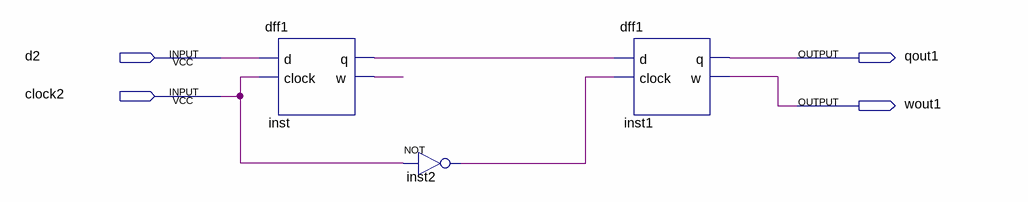
[diagram p0: schematic sheet]
// Quartus schematic msff1.bdf as structural Verilog: 3 symbols, 4 pins
module msff1 (
  input  d2,
  input  clock2,
  output qout1,
  output wout1
);

  wire inst2_out, inst_q, inst_w;

  dff1 inst (.d(d2), .clock(clock2), .q(inst_q), .w(inst_w));
  not inst2 (inst2_out, clock2);
  dff1 inst1 (.d(inst_q), .clock(inst2_out), .q(qout1), .w(wout1));
endmodule
